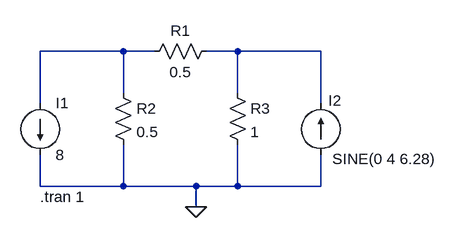
[diagram p0: schematic g3_p5.asc]
g3_p5.asc, the LTspice schematic file:
Version 4
SHEET 1 880 680
WIRE 80 96 -48 96
WIRE 128 96 80 96
WIRE 256 96 208 96
WIRE 384 96 256 96
WIRE 80 160 80 96
WIRE 256 160 256 96
WIRE -48 176 -48 96
WIRE 384 176 384 96
WIRE -48 304 -48 256
WIRE 80 304 80 240
WIRE 80 304 -48 304
WIRE 192 304 80 304
WIRE 256 304 256 240
WIRE 256 304 192 304
WIRE 384 304 384 256
WIRE 384 304 256 304
WIRE 192 336 192 304
FLAG 192 336 0
SYMBOL res 240 144 R0
SYMATTR InstName R3
SYMATTR Value 1
SYMBOL res 64 144 R0
SYMATTR InstName R2
SYMATTR Value 0.5
SYMBOL res 224 80 R90
WINDOW 0 0 56 VBottom 2
WINDOW 3 32 56 VTop 2
SYMATTR InstName R1
SYMATTR Value 0.5
SYMBOL current -48 176 R0
SYMATTR InstName I1
SYMATTR Value 8
SYMBOL current 384 256 R180
WINDOW 0 -32 84 Left 2
WINDOW 3 -178 -6 Left 2
WINDOW 123 0 0 Left 0
WINDOW 39 0 0 Left 0
SYMATTR InstName I2
SYMATTR Value SINE(0 4 6.28)
TEXT -48 320 Left 2 !.tran 1

The netlist it stands for:
* g3_p5.asc
R3 N002 0 1
R2 N001 0 0.5
R1 N002 N001 0.5
I1 N001 0 8
I2 0 N002 SINE(0 4 6.28)
.tran 1
.backanno
.end